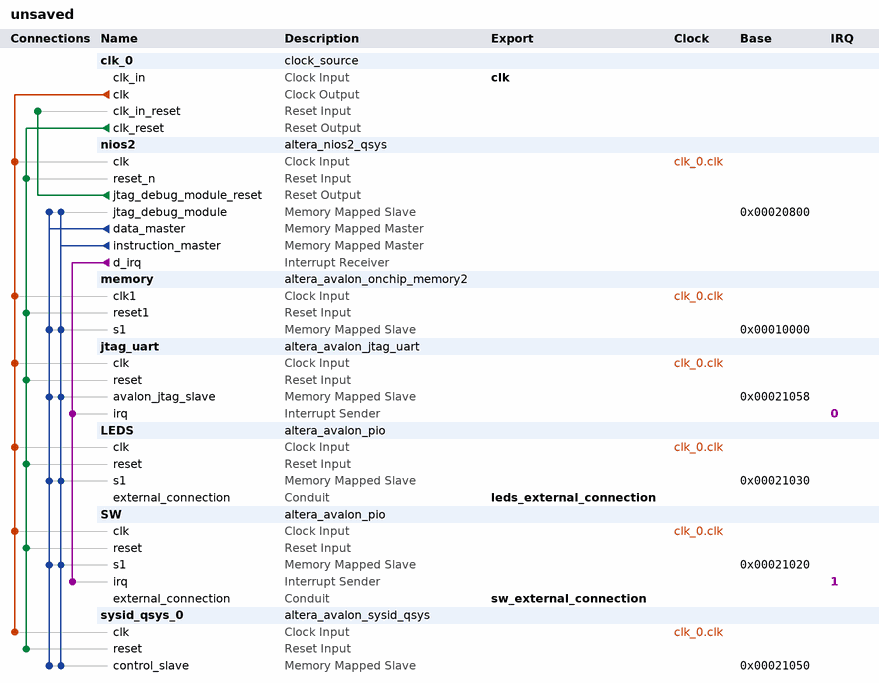
[diagram p0: system contents]
# Platform Designer (Qsys) system unsaved, MAX 10 10M50DAF484C7G
# Parameters at their usual value, and those the tool derives, are not listed.
package require -exact qsys 18.1
create_system unsaved
set_project_property DEVICE_FAMILY {MAX 10}
set_project_property DEVICE 10M50DAF484C7G

add_instance clk_0 clock_source 18.1
set_instance_parameter_value clk_0 clockFrequency 50000000

add_instance nios2 altera_nios2_qsys 16.1
set_instance_parameter_value nios2 breakSlave nios2.jtag_debug_module
set_instance_parameter_value nios2 exceptionSlave memory.s1
set_instance_parameter_value nios2 icache_size 4096
set_instance_parameter_value nios2 impl Tiny
set_instance_parameter_value nios2 mmu_TLBMissExcSlave None
set_instance_parameter_value nios2 muldiv_multiplierType DSPBlock
set_instance_parameter_value nios2 resetSlave memory.s1
set_instance_parameter_value nios2 resetrequest_enabled true

add_instance memory altera_avalon_onchip_memory2 18.1
set_instance_parameter_value memory dataWidth 32
set_instance_parameter_value memory dualPort false
set_instance_parameter_value memory initMemContent true
set_instance_parameter_value memory initializationFileName onchip_mem.hex
set_instance_parameter_value memory memorySize 40000

add_instance jtag_uart altera_avalon_jtag_uart 18.1
set_instance_parameter_value jtag_uart simInteractiveOptions NO_INTERACTIVE_WINDOWS

add_instance LEDS altera_avalon_pio 18.1
set_instance_parameter_value LEDS direction Output
set_instance_parameter_value LEDS width 10

add_instance SW altera_avalon_pio 18.1
set_instance_parameter_value SW captureEdge true
set_instance_parameter_value SW direction Input
set_instance_parameter_value SW generateIRQ true
set_instance_parameter_value SW irqType EDGE
set_instance_parameter_value SW width 2

add_instance sysid_qsys_0 altera_avalon_sysid_qsys 18.1
set_instance_parameter_value sysid_qsys_0 id 0

# connections
add_connection clk_0.clk jtag_uart.clk clock
add_connection clk_0.clk LEDS.clk clock
add_connection clk_0.clk memory.clk1 clock
add_connection clk_0.clk nios2.clk clock
add_connection clk_0.clk SW.clk clock
add_connection clk_0.clk sysid_qsys_0.clk clock
add_connection clk_0.clk_reset jtag_uart.reset reset
add_connection clk_0.clk_reset LEDS.reset reset
add_connection clk_0.clk_reset memory.reset1 reset
add_connection clk_0.clk_reset nios2.reset_n reset
add_connection clk_0.clk_reset SW.reset reset
add_connection clk_0.clk_reset sysid_qsys_0.reset reset
add_connection nios2.jtag_debug_module_reset clk_0.clk_in_reset reset
add_connection nios2.data_master jtag_uart.avalon_jtag_slave avalon
set_connection_parameter_value nios2.data_master/jtag_uart.avalon_jtag_slave baseAddress 0x00021058
add_connection nios2.data_master LEDS.s1 avalon
set_connection_parameter_value nios2.data_master/LEDS.s1 baseAddress 0x00021030
add_connection nios2.data_master memory.s1 avalon
set_connection_parameter_value nios2.data_master/memory.s1 baseAddress 0x00010000
add_connection nios2.data_master nios2.jtag_debug_module avalon
set_connection_parameter_value nios2.data_master/nios2.jtag_debug_module baseAddress 0x00020800
add_connection nios2.data_master SW.s1 avalon
set_connection_parameter_value nios2.data_master/SW.s1 baseAddress 0x00021020
add_connection nios2.data_master sysid_qsys_0.control_slave avalon
set_connection_parameter_value nios2.data_master/sysid_qsys_0.control_slave baseAddress 0x00021050
add_connection nios2.instruction_master jtag_uart.avalon_jtag_slave avalon
set_connection_parameter_value nios2.instruction_master/jtag_uart.avalon_jtag_slave baseAddress 0x00021058
add_connection nios2.instruction_master LEDS.s1 avalon
set_connection_parameter_value nios2.instruction_master/LEDS.s1 baseAddress 0x00021030
add_connection nios2.instruction_master memory.s1 avalon
set_connection_parameter_value nios2.instruction_master/memory.s1 baseAddress 0x00010000
add_connection nios2.instruction_master nios2.jtag_debug_module avalon
set_connection_parameter_value nios2.instruction_master/nios2.jtag_debug_module baseAddress 0x00020800
add_connection nios2.instruction_master SW.s1 avalon
set_connection_parameter_value nios2.instruction_master/SW.s1 baseAddress 0x00021020
add_connection nios2.instruction_master sysid_qsys_0.control_slave avalon
set_connection_parameter_value nios2.instruction_master/sysid_qsys_0.control_slave baseAddress 0x00021050
add_connection nios2.d_irq jtag_uart.irq interrupt
set_connection_parameter_value nios2.d_irq/jtag_uart.irq irqNumber 0
add_connection nios2.d_irq SW.irq interrupt
set_connection_parameter_value nios2.d_irq/SW.irq irqNumber 1

# exported interfaces
add_interface clk clock sink
set_interface_property clk EXPORT_OF clk_0.clk_in
add_interface leds_external_connection conduit end
set_interface_property leds_external_connection EXPORT_OF LEDS.external_connection
add_interface sw_external_connection conduit end
set_interface_property sw_external_connection EXPORT_OF SW.external_connection

set_interconnect_requirement {$system} qsys_mm.clockCrossingAdapter HANDSHAKE
set_interconnect_requirement {$system} qsys_mm.enableEccProtection FALSE
set_interconnect_requirement {$system} qsys_mm.insertDefaultSlave FALSE
set_interconnect_requirement {$system} qsys_mm.maxAdditionalLatency 1

save_system unsaved.qsys
